# Altium schematic sheet Power.SchDoc
size 594 x 420 mm; SheetNumber: 1; SheetTotal: 3
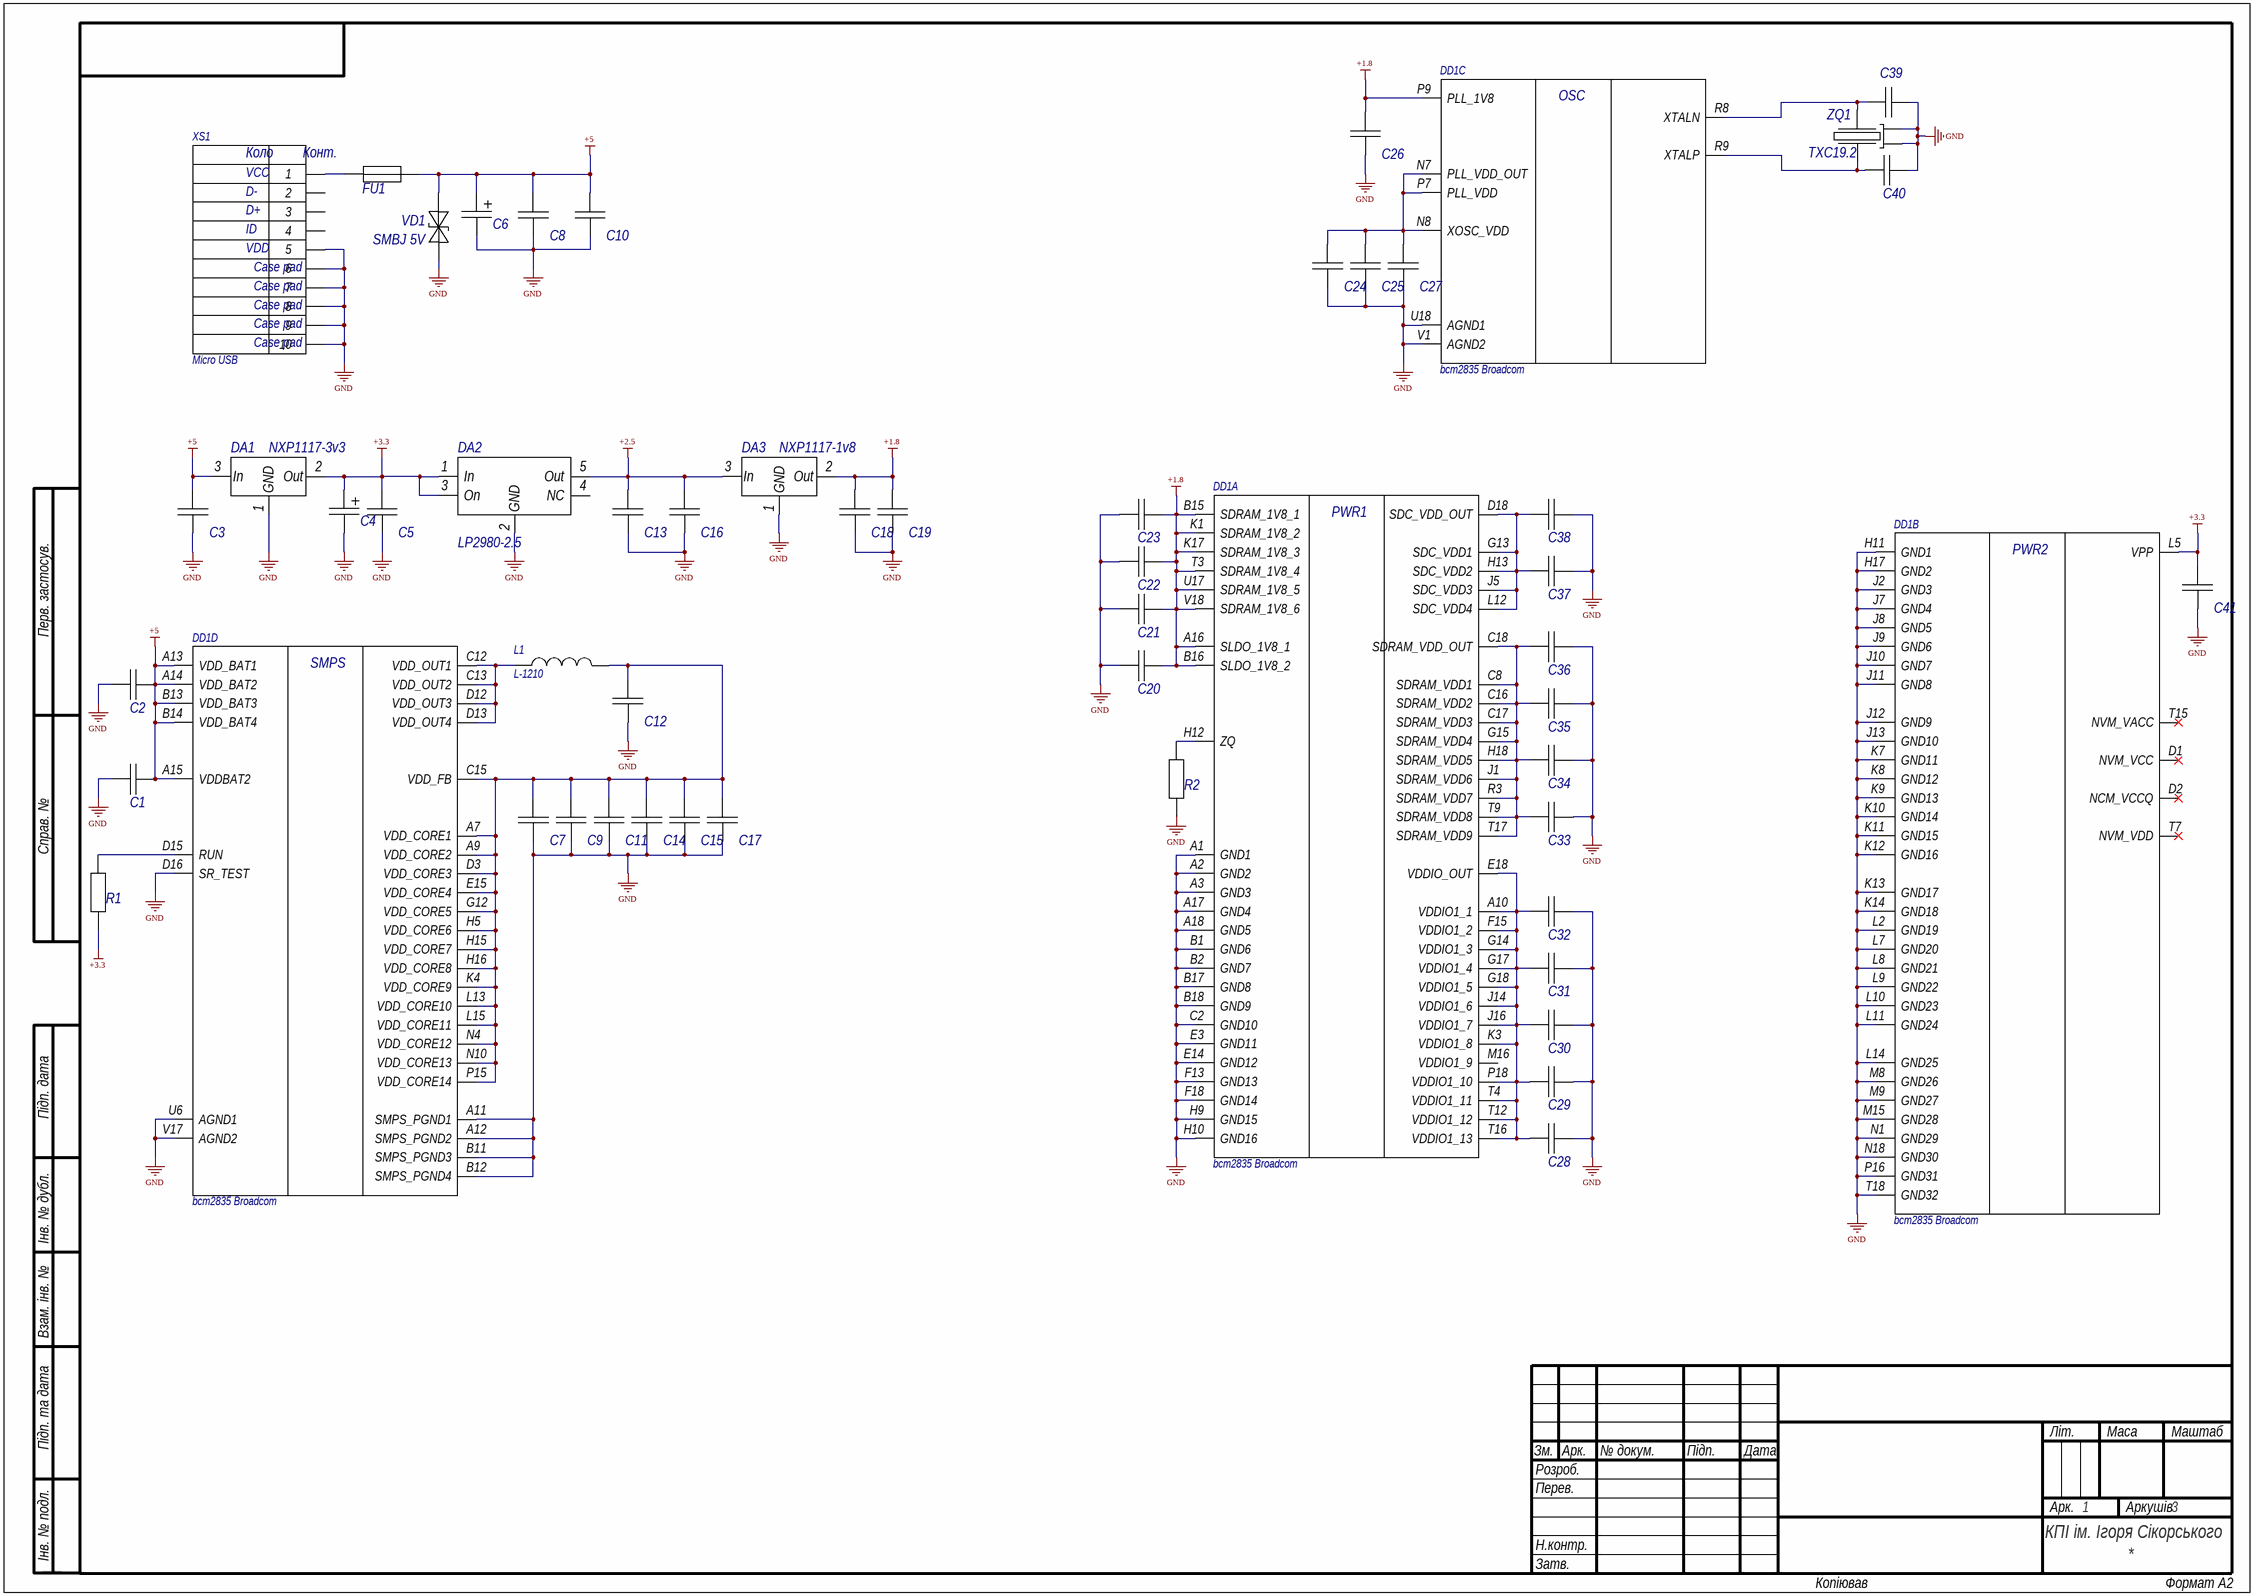
[diagram p0: Power.SchDoc]

## Parts
C1  C-0603 * * * * *  [С-0603]  (value not drawn)
C2  C-0603 * * * * *  [С-0603]  (value not drawn)
C3  C-0805 * * * * *  [C-0805-KEM]  (value not drawn)
C4  C * * * * *  [PCAP_SVP_C6_PAN]  (value not drawn)
C5  C-0805 * * * * *  [C-0805-KEM]  (value not drawn)
C6  C * * * * *  [PCAP_SVP_C6_PAN]  (value not drawn)
C7  C-0603 * * * * *  [С-0603]  (value not drawn)
C8  C-1206 * * * * *  [C-1206]  (value not drawn)
C9  C-0603 * * * * *  [С-0603]  (value not drawn)
C10  C-0805 * * * * *  [C-0805-KEM]  (value not drawn)
C11  C-0603 * * * * *  [С-0603]  (value not drawn)
C12  C-1206 * * * * *  [C-1206]  (value not drawn)
C13  C-1206 * * * * *  [C-1206]  (value not drawn)
C14  C-0603 * * * * *  [С-0603]  (value not drawn)
C15  C-0603 * * * * *  [С-0603]  (value not drawn)
C16  C-0805 * * * * *  [C-0805-KEM]  (value not drawn)
C17  C-0603 * * * * *  [С-0603]  (value not drawn)
C18  C-0805 * * * * *  [C-0805-KEM]  (value not drawn)
C19  C-0603 * * * * *  [С-0603]  (value not drawn)
C20  C-0603 * * * * *  [С-0603]  (value not drawn)
C21  C-0603 * * * * *  [С-0603]  (value not drawn)
C22  C-0603 * * * * *  [С-0603]  (value not drawn)
C23  C-0603 * * * * *  [С-0603]  (value not drawn)
C24  C-0603 * * * * *  [С-0603]  (value not drawn)
C25  C-0603 * * * * *  [С-0603]  (value not drawn)
C26  C-0603 * * * * *  [С-0603]  (value not drawn)
C27  C-0603 * * * * *  [С-0603]  (value not drawn)
C28  C-0603 * * * * *  [С-0603]  (value not drawn)
C29  C-0603 * * * * *  [С-0603]  (value not drawn)
C30  C-0603 * * * * *  [С-0603]  (value not drawn)
C31  C-0603 * * * * *  [С-0603]  (value not drawn)
C32  C-0603 * * * * *  [С-0603]  (value not drawn)
C33  C-0603 * * * * *  [С-0603]  (value not drawn)
C34  C-0603 * * * * *  [С-0603]  (value not drawn)
C35  C-0603 * * * * *  [С-0603]  (value not drawn)
C36  C-0603 * * * * *  [С-0603]  (value not drawn)
C37  C-0603 * * * * *  [С-0603]  (value not drawn)
C38  C-0603 * * * * *  [С-0603]  (value not drawn)
C39  C-0402 * * * * *  [C-0402]  (value not drawn)
C40  C-0402 * * * * *  [C-0402]  (value not drawn)
C41  C-0603 * * * * *  [С-0603]  (value not drawn)
DA1  NXP1117-3v3  [D2PAK3_ONS]
DA2  LP2980-2.5  [MF05A_TEX-L]
DA3  NXP1117-1v8  [D2PAK3_ONS]
DD1  bcm2835 Broadcom  [BGA81C65P18X18_1200X1200]  (parts A,B,C,D of 16)
FU1  F-1206 * * * *  [FUSE_1206]  (value not drawn)
L1  L-1210  [IND_NC_SUM]
R1  R-0603 * * * *  [R-0603]  (value not drawn)
R2  R-0603 * * * *  [R-0603]  (value not drawn)
VD1  SMBJ 5V *  [SMB_STM]  (value not drawn)
XS1  Micro USB  [micro-usb]
ZQ1  TXC19.2 *  [CRYSTAL_TXC_7B]  (value not drawn)

## Nets
+1.8: C18.2 C19.2 C20.2 C21.2 C22.2 C23.2 C26.2 DA3.2(Out) DD1.A16(SLDO_1V8_1) DD1.B15(SDRAM_1V8_1) DD1.B16(SLDO_1V8_2) DD1.K1(SDRAM_1V8_2) DD1.K17(SDRAM_1V8_3) DD1.P9(PLL_1V8) DD1.T3(SDRAM_1V8_4) DD1.U17(SDRAM_1V8_5) DD1.V18(SDRAM_1V8_6)
+2.5: C13.2 C16.2 DA2.5(Out) DA3.3(In)
+3.3: C4.1 C5.2 C41.2 DA1.2(Out) DA2.1(In) DA2.3(On) DD1.L5(VPP) R1.2
+5: C1.1 C2.1 C3.2 C6.1 C8.2 C10.2 DA1.3(In) DD1.A13(VDD_BAT1) DD1.A14(VDD_BAT2) DD1.A15(VDDBAT2) DD1.B13(VDD_BAT3) DD1.B14(VDD_BAT4) FU1.2 VD1.2
GND: C1.2 C2.2 C3.1 C4.2 C5.1 C6.2 C7.1 C8.1 C9.1 C10.1 C11.1 C12.1 C13.1 C14.1 C15.1 C16.1 C17.1 C18.1 C19.1 C20.1 C21.1 C22.1 C23.1 C24.1 C25.1 C26.1 C27.1 C28.1 C29.1 C30.1 C31.1 C32.1 C33.1 C34.1 C35.1 C36.1 C37.1 C38.1 C39.2 C40.2 C41.1 DA1.1(GND) DA2.2(GND) DA3.1(GND) DD1.A1(GND1) DD1.A2(GND2) DD1.A3(GND3) DD1.A11(SMPS_PGND1) DD1.A12(SMPS_PGND2) DD1.A17(GND4) DD1.A18(GND5) DD1.B1(GND6) DD1.B2(GND7) DD1.B11(SMPS_PGND3) DD1.B12(SMPS_PGND4) DD1.B17(GND8) DD1.B18(GND9) DD1.C2(GND10) DD1.D16(SR_TEST) DD1.E3(GND11) DD1.E14(GND12) DD1.F13(GND13) DD1.F18(GND14) DD1.H9(GND15) DD1.H10(GND16) DD1.H11(GND1) DD1.H17(GND2) DD1.J2(GND3) DD1.J7(GND4) DD1.J8(GND5) DD1.J9(GND6) DD1.J10(GND7) DD1.J11(GND8) DD1.J12(GND9) DD1.J13(GND10) DD1.K7(GND11) DD1.K8(GND12) DD1.K9(GND13) DD1.K10(GND14) DD1.K11(GND15) DD1.K12(GND16) DD1.K13(GND17) DD1.K14(GND18) DD1.L2(GND19) DD1.L7(GND20) DD1.L8(GND21) DD1.L9(GND22) DD1.L10(GND23) DD1.L11(GND24) DD1.L14(GND25) DD1.M8(GND26) DD1.M9(GND27) DD1.M15(GND28) DD1.N1(GND29) DD1.N18(GND30) DD1.P16(GND31) DD1.T18(GND32) DD1.U6(AGND1) DD1.U18(AGND1) DD1.V1(AGND2) DD1.V17(AGND2) R2.1 VD1.1 XS1.5 XS1.6 XS1.7 XS1.8 XS1.9 XS1.10 ZQ1.2 ZQ1.4
NetC7_2: C7.2 C9.2 C11.2 C12.2 C14.2 C15.2 C17.2 DD1.A7(VDD_CORE1) DD1.A9(VDD_CORE2) DD1.C15(VDD_FB) DD1.D3(VDD_CORE3) DD1.E15(VDD_CORE4) DD1.G12(VDD_CORE5) DD1.H5(VDD_CORE6) DD1.H15(VDD_CORE7) DD1.H16(VDD_CORE8) DD1.K4(VDD_CORE9) DD1.L13(VDD_CORE10) DD1.L15(VDD_CORE11) DD1.N4(VDD_CORE12) DD1.N10(VDD_CORE13) DD1.P15(VDD_CORE14) L1.2
NetC24_2: C24.2 C25.2 C27.2 DD1.N7(PLL_VDD_OUT) DD1.N8(XOSC_VDD) DD1.P7(PLL_VDD)
NetC28_2: C28.2 C29.2 C30.2 C31.2 C32.2 DD1.A10(VDDIO1_1) DD1.E18(VDDIO_OUT) DD1.F15(VDDIO1_2) DD1.G14(VDDIO1_3) DD1.G17(VDDIO1_4) DD1.G18(VDDIO1_5) DD1.J14(VDDIO1_6) DD1.J16(VDDIO1_7) DD1.K3(VDDIO1_8) DD1.P18(VDDIO1_10) DD1.T4(VDDIO1_11) DD1.T12(VDDIO1_12) DD1.T16(VDDIO1_13)
NetC33_2: C33.2 C34.2 C35.2 C36.2 DD1.G15(SDRAM_VDD4) DD1.H18(SDRAM_VDD5) DD1.J1(SDRAM_VDD6) DD1.R3(SDRAM_VDD7) DD1.T9(SDRAM_VDD8) DD1.T17(SDRAM_VDD9) DD1.С8(SDRAM_VDD1) DD1.С16(SDRAM_VDD2) DD1.С17(SDRAM_VDD3) DD1.С18(SDRAM_VDD_OUT)
NetC37_2: C37.2 C38.2 DD1.D18(SDC_VDD_OUT) DD1.G13(SDC_VDD1) DD1.H13(SDC_VDD2) DD1.J5(SDC_VDD3) DD1.L12(SDC_VDD4)
NetC39_1: C39.1 DD1.R8(XTALN) ZQ1.3
NetC40_1: C40.1 DD1.R9(XTALP) ZQ1.1
NetDD1_C12: DD1.C12(VDD_OUT1) DD1.C13(VDD_OUT2) DD1.D12(VDD_OUT3) DD1.D13(VDD_OUT4) L1.1
NetDD1_D15: DD1.D15(RUN) R1.1
NetDD1_H12: DD1.H12(ZQ) R2.2
NetFU1_1: FU1.1 XS1.1

Not connected (* = marked no-connect by the designer): DA2 4(NC); DD1 D1(NVM_VCC)* D2(NCM_VCCQ)* M16(VDDIO1_9) T7(NVM_VDD)* T15(NVM_VACC)*; XS1 2 3 4

## Notes on the sheet
- Перв. застосув.
- Справ. №
- Підп. дата
- Інв. № дубл.
- Взам. інв. №
- Підп. та дата
- Зм.
- Розроб.
- Арк.
- № докум.
- Підп.
- Дата
- Літ.
- Маса
- Маштаб
- Перев.
- Аркушів
- Інв. № подл.
- Н.контр.
- Затв.
- КПІ ім. Ігоря Сікорського
- ALTIUM GOSTBOM2.0 KEV
- Копіював
- Формат А2
- (in symbol bcm2835, part A) PWR1
- (in symbol bcm2835, part B) PWR2
- (in symbol bcm2835, part C) OSC
- (in symbol bcm2835, part D) SMPS
- (in symbol Micro-USB) Коло; Конт.; VCC; D-; D+; ID; VDD; Case pad

## Library data of the parts
C1 C2 C7 C9 C11 C14 C15 C17 C19-C38 C41 = С-0603: Generic; Manufacturer: *; Tolerance: *; Package: C-0603; Temp_Coef: *; Voltage: *; Value: *
C3 C5 C10 C16 C18 = С-0805: Generic; Manufacturer: *; Tolerance: *; Package: C-0805; Temp_Coef: *; Voltage: *; Value: *
C4 C6 = С: Generic electrolite SMT capacitor; Manufacturer: *; Tolerance: *; Package: C; Temp_Coef: *; Voltage: *; Value: *
C8 C12 C13 = С-1206: Generic; Manufacturer: *; Tolerance: *; Package: C-1206; Temp_Coef: *; Voltage: *; Value: *
C39 C40 = С-0402: Generic; Manufacturer: *; Tolerance: *; Package: C-0402; Temp_Coef: *; Voltage: *; Value: *
DA1 = NXP1117-3v3: LDO aat output 3.3V
DA2 = LP2980-2.5: LDO at output 2.5V
DA3 = NXP1117-1v8: LDO aat output 1.8V
DD1 = bcm2835: BCM2835 ARM-based processor; Manufacturer: Broadcom; Name: bcm2835
FU1 = F-1206: Generic Fuse 1206; Manufacturer: *; Tolerance: *; Package: F-1206; Power: *; Value: *
L1 = L-1210: Inductor; Name: L-1210
R1 R2 = R-0603: Generic; Manufacturer: *; Tolerance: *; Package: R-0603; Power: *; Value: *
VD1 = SMBJ 5V: TVS 5V Diode; Manufacturer: *; Name: SMBJ 5V
XS1 = Micro-USB: Micro-USB connector for SMT mounting; Name: kls1-tf
ZQ1 = TXC19.2: TXC19.2 crystal 19.2 MHz; Manufacturer: *; Value: *; Name: TXC19.2